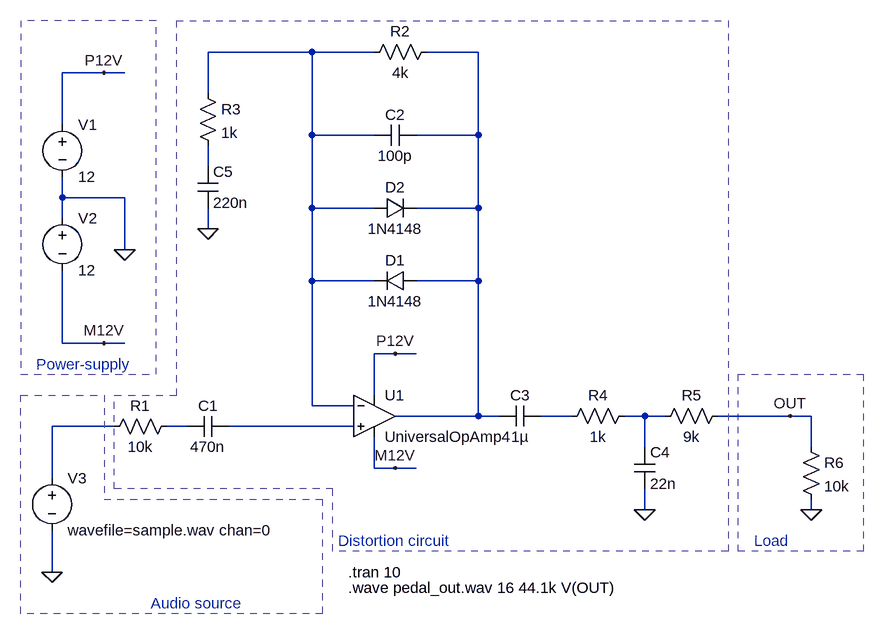
[diagram p0: schematic distortion_pedal_sound.asc]
distortion_pedal_sound.asc, the LTspice schematic file:
Version 4
SHEET 1 1440 780
WIRE 192 -864 32 -864
WIRE 288 -864 192 -864
WIRE 448 -864 368 -864
WIRE -128 -832 -192 -832
WIRE -96 -832 -128 -832
WIRE 32 -800 32 -864
WIRE -192 -752 -192 -832
WIRE 192 -736 192 -864
WIRE 288 -736 192 -736
WIRE 448 -736 448 -864
WIRE 448 -736 352 -736
WIRE 32 -688 32 -720
WIRE -192 -640 -192 -672
WIRE -96 -640 -192 -640
WIRE 192 -624 192 -736
WIRE 288 -624 192 -624
WIRE 448 -624 448 -736
WIRE 448 -624 352 -624
WIRE -192 -608 -192 -640
WIRE 32 -592 32 -624
WIRE -96 -560 -96 -640
WIRE 192 -512 192 -624
WIRE 288 -512 192 -512
WIRE 448 -512 448 -624
WIRE 448 -512 352 -512
WIRE -192 -416 -192 -528
WIRE -128 -416 -192 -416
WIRE -96 -416 -128 -416
WIRE 320 -400 288 -400
WIRE 352 -400 320 -400
WIRE 288 -336 288 -400
WIRE 192 -320 192 -512
WIRE 256 -320 192 -320
WIRE 448 -304 448 -512
WIRE 448 -304 320 -304
WIRE 480 -304 448 -304
WIRE 592 -304 544 -304
WIRE 704 -304 672 -304
WIRE 736 -304 704 -304
WIRE 928 -304 816 -304
WIRE 960 -304 928 -304
WIRE -112 -288 -208 -288
WIRE 0 -288 -32 -288
WIRE 256 -288 64 -288
WIRE 704 -256 704 -304
WIRE 960 -256 960 -304
WIRE 288 -224 288 -272
WIRE 320 -224 288 -224
WIRE 352 -224 320 -224
WIRE -208 -208 -208 -288
WIRE 704 -160 704 -192
WIRE 960 -160 960 -176
WIRE -208 -64 -208 -128
FLAG -96 -560 0
FLAG -128 -832 P12V
FLAG -128 -416 M12V
FLAG -208 -64 0
FLAG 320 -400 P12V
FLAG 320 -224 M12V
FLAG 32 -592 0
FLAG 960 -160 0
FLAG 704 -160 0
FLAG 928 -304 OUT
SYMBOL OpAmps\\UniversalOpAmp4 288 -304 R0
SYMATTR InstName U1
SYMBOL voltage -192 -768 R0
WINDOW 123 0 0 Left 0
WINDOW 39 0 0 Left 0
SYMATTR InstName V1
SYMATTR Value 12
SYMBOL voltage -192 -624 R0
WINDOW 123 0 0 Left 0
WINDOW 39 0 0 Left 0
SYMATTR InstName V2
SYMATTR Value 12
SYMBOL cap 64 -304 R90
WINDOW 0 0 32 VBottom 2
WINDOW 3 32 32 VTop 2
SYMATTR InstName C1
SYMATTR Value 470n
SYMBOL res -16 -304 R90
WINDOW 0 0 56 VBottom 2
WINDOW 3 32 56 VTop 2
SYMATTR InstName R1
SYMATTR Value 10k
SYMBOL voltage -208 -224 R0
SYMATTR InstName V3
SYMATTR Value wavefile=sample.wav chan=0
SYMBOL diode 352 -528 R90
WINDOW 0 0 32 VBottom 2
WINDOW 3 32 32 VTop 2
SYMATTR InstName D1
SYMATTR Value 1N4148
SYMBOL diode 288 -608 R270
WINDOW 0 32 32 VTop 2
WINDOW 3 0 32 VBottom 2
SYMATTR InstName D2
SYMATTR Value 1N4148
SYMBOL cap 352 -752 R90
WINDOW 0 0 32 VBottom 2
WINDOW 3 32 32 VTop 2
SYMATTR InstName C2
SYMATTR Value 100p
SYMBOL res 384 -880 R90
WINDOW 0 0 56 VBottom 2
WINDOW 3 32 56 VTop 2
SYMATTR InstName R2
SYMATTR Value 4k
SYMBOL res 16 -816 R0
SYMATTR InstName R3
SYMATTR Value 1k
SYMBOL cap 544 -320 R90
WINDOW 0 0 32 VBottom 2
WINDOW 3 32 32 VTop 2
SYMATTR InstName C3
SYMATTR Value 1µ
SYMBOL res 688 -320 R90
WINDOW 0 0 56 VBottom 2
WINDOW 3 32 56 VTop 2
SYMATTR InstName R4
SYMATTR Value 1k
SYMBOL res 832 -320 R90
WINDOW 0 0 56 VBottom 2
WINDOW 3 32 56 VTop 2
SYMATTR InstName R5
SYMATTR Value 9k
SYMBOL res 944 -272 R0
SYMATTR InstName R6
SYMATTR Value 10k
SYMBOL cap 688 -256 R0
SYMATTR InstName C4
SYMATTR Value 22n
SYMBOL cap 16 -688 R0
SYMATTR InstName C5
SYMATTR Value 220n
TEXT 248 -64 Left 2 !.tran 10
TEXT 248 -40 Left 2 !.wave pedal_out.wav 16 44.1k V(OUT)
TEXT 872 -112 Left 2 ;Load
TEXT 232 -112 Left 2 ;Distortion circuit
TEXT -56 -16 Left 2 ;Audio source
TEXT -232 -384 Left 2 ;Power-supply
LINE Normal -256 0 -256 -336 2
LINE Normal 208 0 -256 0 2
LINE Normal 208 -176 208 0 2
LINE Normal -128 -176 208 -176 2
LINE Normal -128 -336 -128 -176 2
LINE Normal -256 -336 -128 -336 2
LINE Normal 224 -192 -112 -192 2
LINE Normal 224 -96 224 -192 2
LINE Normal 832 -96 224 -96 2
LINE Normal 832 -912 832 -96 2
LINE Normal -16 -912 832 -912 2
LINE Normal -16 -336 -16 -912 2
LINE Normal -112 -336 -16 -336 2
LINE Normal -112 -192 -112 -336 2
LINE Normal -48 -368 -48 -912 2
LINE Normal -256 -368 -48 -368 2
LINE Normal -256 -912 -256 -368 2
LINE Normal -48 -912 -256 -912 2
LINE Normal 848 -96 848 -368 2
LINE Normal 1040 -96 848 -96 2
LINE Normal 1040 -368 1040 -96 2
LINE Normal 848 -368 1040 -368 2

The netlist it stands for:
* distortion_pedal_sound.asc
* U1: UniversalOpAmp4 (symbol OpAmps\UniversalOpAmp4 not available, pins judged from their places): In+=N008 In-=N001 V+=P12V V-=M12V OUT=N002
V1 P12V 0 12
V2 0 M12V 12
C1 N008 N007 470n
R1 N007 N006 10k
V3 N006 0 wavefile=sample.wav chan=0
D1 N002 N001 1N4148
D2 N001 N002 1N4148
C2 N002 N001 100p
R2 N002 N001 4k
R3 N001 N003 1k
C3 N004 N002 1µ
R4 N005 N004 1k
R5 OUT N005 9k
R6 OUT 0 10k
C4 N005 0 22n
C5 N003 0 220n
.model D D
.lib standard.dio
.tran 10
.wave pedal_out.wav 16 44.1k V(OUT)
* Load
* Distortion circuit
* Audio source
* Power-supply
.backanno
.end